# EAGLE design Voyager-expanded_stm_6+ (EAGLE 9.4.2)
Assembly variants: Testing
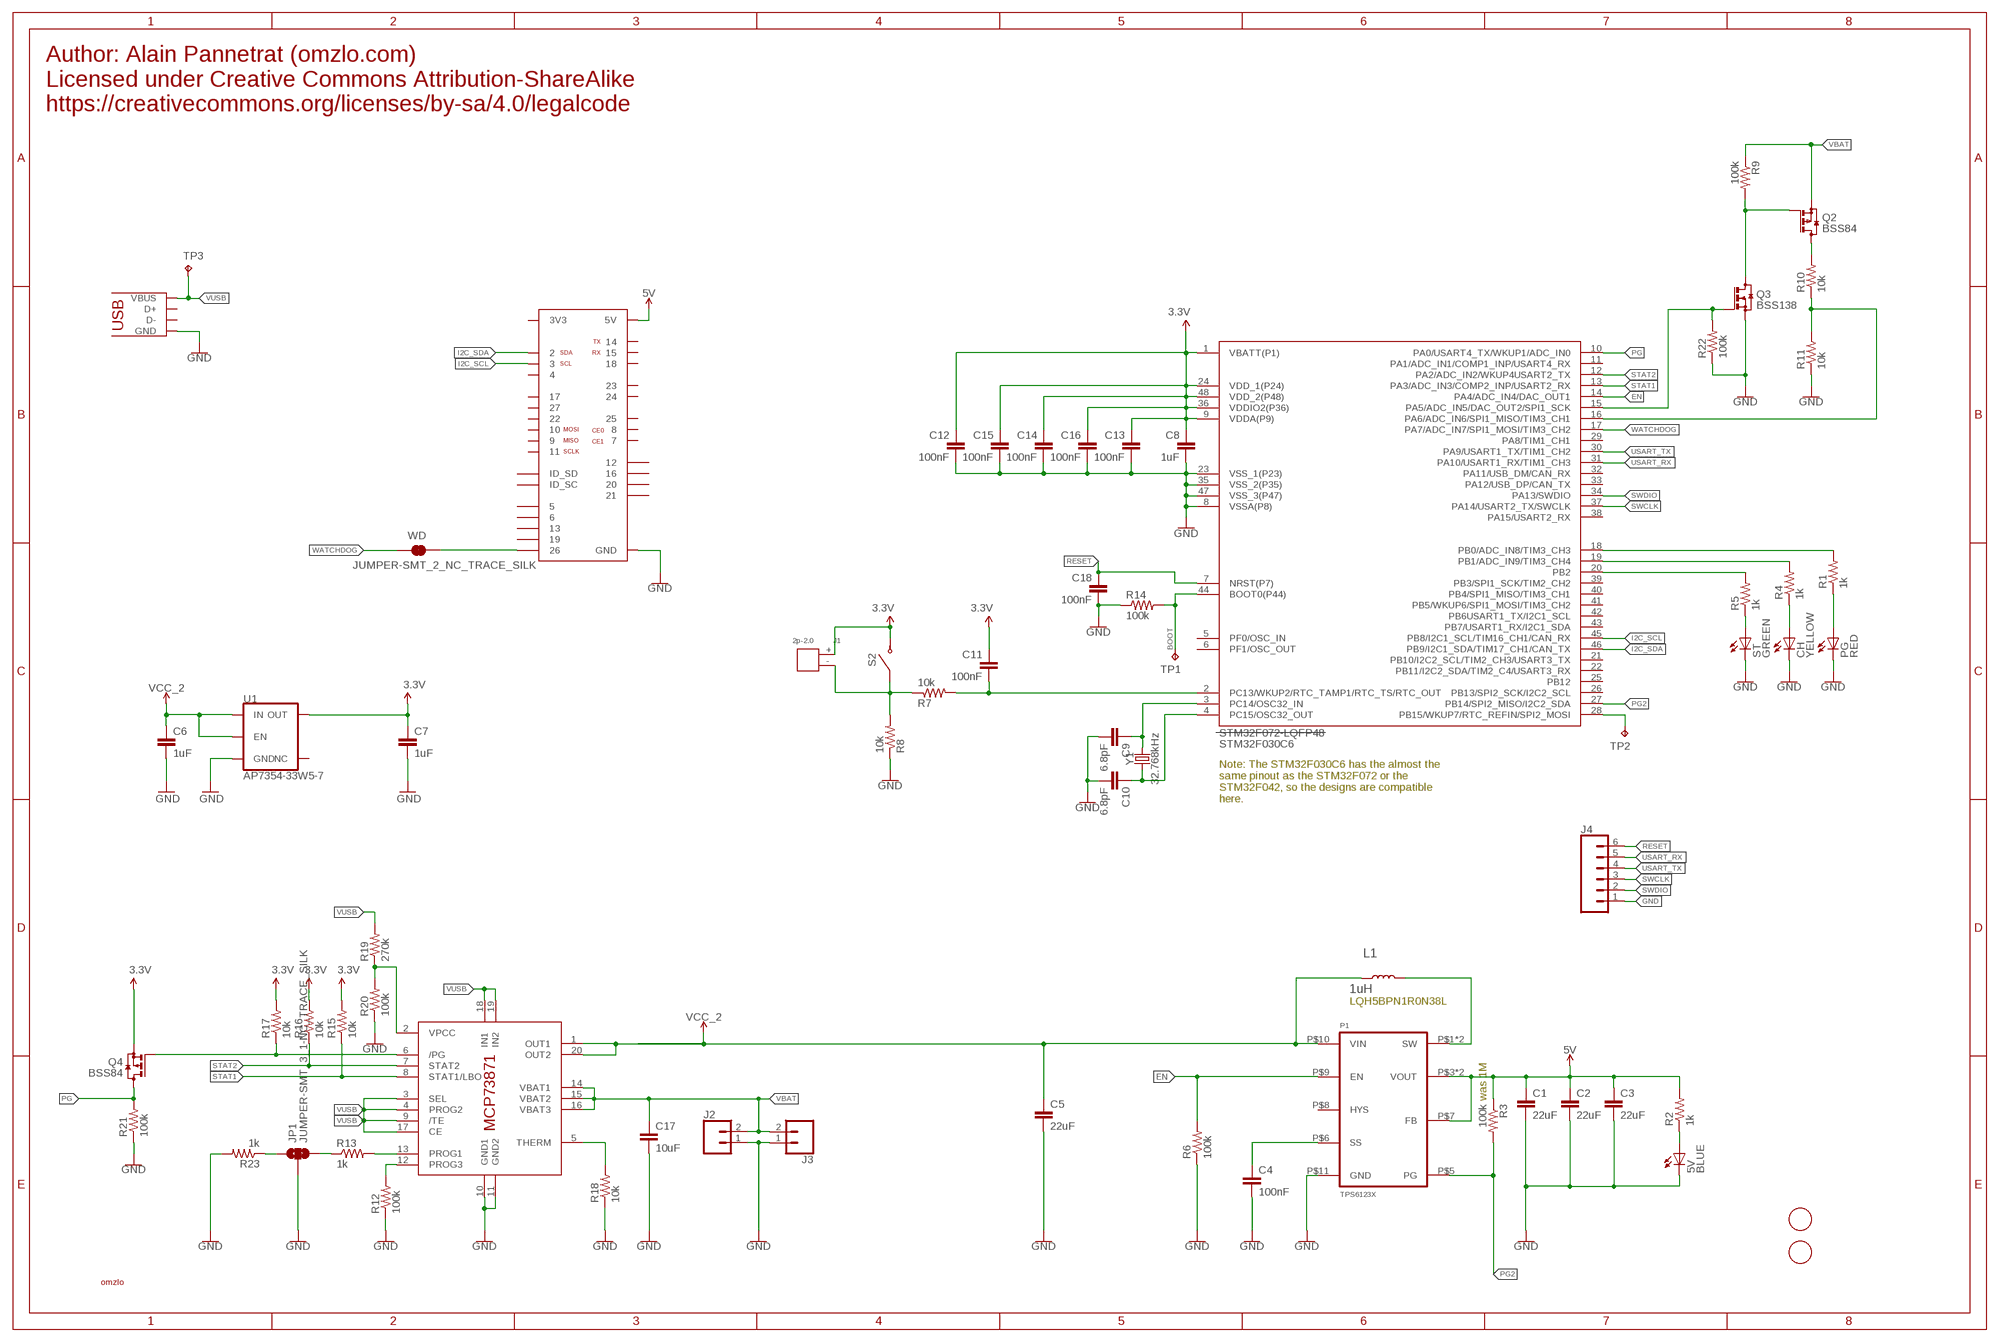
[diagram p0: schematic, sheet 1]

## Parts
5V  BLUE  LEDCHIP-LED0805  [CHIP-LED0805]
C1  22uF  C-EUC1206  [C1206]
C2  22uF  C-EUC1206  [C1206]
C3  22uF  C-EUC1206  [C1206]
C4  100nF  C-EUC0603  [C0603]
C5  22uF  C-EUC1206  [C1206]
C6  1uF  CAP0805  [0805]
C7  1uF  CAP0805  [0805]
C8  1uF  CAP0805  [0805]
C9  6.8pF  C-EUC0603  [C0603]
C10  6.8pF  C-EUC0603  [C0603]
C11  100nF  C-EUC0603  [C0603]
C12  100nF  C-EUC0603  [C0603]
C13  100nF  C-EUC0603  [C0603]
C14  100nF  C-EUC0603  [C0603]
C15  100nF  C-EUC0603  [C0603]
C16  100nF  C-EUC0603  [C0603]
C17  10uF  C-EUC0805  [C0805]
C18  100nF  C-EUC0603  [C0603]
CH  YELLOW  LEDCHIP-LED0805  [CHIP-LED0805]
IC1  MCP73871  [QFN20]
J1  2p-2.0  DIP-JST-2P-2.0  [H2-2.0-6X4.5MM]
J2  CONN_021X02_NO_SILK  [1X02_NO_SILK]
J3  CONN_02-JST-2MM-SMT  [JST-2-SMD]
J4  CONN_06NO_SILK_FEMALE_PTH  [1X06_NO_SILK]
JP1  JUMPER-SMT_3_1-NC_TRACE_SILK  [SMT-JUMPER_3_1-NC_TRACE_SILK]
L1  1uH  SMD-INDUCTOR-10UH-20%-2.35A(2P-5X5X4MM)  [L5040S]
P1  TPS6123X  [PVSON-10]
PG  RED  LEDCHIP-LED0805  [CHIP-LED0805]
Q2  BSS84  [SOT23]
Q3  BSS138  BSS123  [SOT23]
Q4  BSS84  [SOT23]
R1  1k  R-US_R0603  [R0603]
R2  1k  R-US_R0603  [R0603]
R3  100k  R-US_R0603  [R0603]
R4  1k  R-US_R0603  [R0603]
R5  1k  R-US_R0603  [R0603]
R6  100k  R-US_R0603  [R0603]
R7  10k  R-US_R0603  [R0603]
R8  10k  R-US_R0603  [R0603]
R9  100k  R-US_R0603  [R0603]
R10  10k  R-US_R0603  [R0603]
R11  10k  R-US_R0603  [R0603]
R12  100k  R-US_R0603  [R0603]
R13  1k  R-US_R0603  [R0603]
R14  100k  R-US_R0603  [R0603]
R15  10k  R-US_R0603  [R0603]
R16  10k  R-US_R0603  [R0603]
R17  10k  R-US_R0603  [R0603]
R18  10k  R-US_R0603  [R0603]
R19  270k  R-US_R0603  [R0603]
R20  100k  R-US_R0603  [R0603]
R21  100k  R-US_R0603  [R0603]
R22  100k  R-US_R0603  [R0603]
R23  1k  R-US_R0603  [R0603]
S2  TACT-SWITCH  [ALPS-SKSCPDE010]
ST  GREEN  LEDCHIP-LED0805  [CHIP-LED0805]
TP1  TPB1,27  [B1,27]
TP2  TPB1,27  [B1,27]
TP3  TPB1,27  [B1,27]
U1  AP7354-33W5-7  MIC5504-3.33.3V  [SOT23-5]
U$1  RASPBERRY-PI-GPIO  [2X20]
U$2  STM32F072-LQFP48  [LQFP48]
U$3  USB-MICROB  [USB-MICROB]
U$4  FIDUCIAL  [FIDUCIAL_1MM]
U$6  OMZLO  [OMZLO]
U$9  FIDUCIAL  [FIDUCIAL_1MM]
WD  JUMPER-SMT_2_NC_TRACE_SILK  [SMT-JUMPER_2_NC_TRACE_SILK]
Y1  32.768kHz  CRYSTAL-32.768KHZSMD-3.2X1.5  [CRYSTAL-SMD-3.2X1.5MM]

## Nets
3.3V [power]: C7.1 C8.1 C11.1 C12.1 C13.1 C14.1 C15.1 C16.1 J1.+ Q4.2(S) R15.2 R16.2 R17.2 S2.P$3 S2.P$4 U1.5(OUT) U$2.1(VBATT(P1)) U$2.9(VDDA(P9)) U$2.24(VDD_1(P24)) U$2.36(VDDIO2(P36)) U$2.48(VDD_2(P48))
5V: C1.1 C2.1 C3.1 P1.P$3(VOUT) P1.P$4(VOUT) P1.P$7(FB) R2.2 R3.1 U$1.2(5V) U$1.4(5V)
BOOT: R14.2 TP1.TP U$2.44(BOOT0(P44))
EN: P1.P$9(EN) R6.2 U$2.14(PA4/ADC_IN4/DAC_OUT1)
GND: 5V.C C1.2 C2.2 C3.2 C4.2 C5.2 C6.2 C7.2 C8.2 C9.2 C10.2 C12.2 C13.2 C14.2 C15.2 C16.2 C17.2 C18.2 CH.C IC1.10(GND1) IC1.11(GND2) J2.1 J3.1 J4.1 JP1.2 P1.P$11(GND) PG.C Q3.2(S) R6.1 R8.1 R11.1 R12.1 R14.1 R18.1 R20.1 R21.1 R22.1 R23.2 ST.C U1.2(GND) U$1.6(GND) U$1.9(GND) U$1.14(GND) U$1.20(GND) U$1.25(GND) U$1.30(GND) U$1.34(GND) U$1.39(GND) U$2.8(VSSA(P8)) U$2.23(VSS_1(P23)) U$2.35(VSS_2(P35)) U$2.47(VSS_3(P47)) U$3.GND U$3.MT1(GND) U$3.MT2(GND) U$3.P$1(GND) U$3.P$2(GND) U$3.P$3(GND) U$3.P$4(GND)
I2C_SCL: U$1.5 U$2.45(PB8/I2C1_SCL/TIM16_CH1/CAN_RX)
I2C_SDA: U$1.3 U$2.46(PB9/I2C1_SDA/TIM17_CH1/CAN_TX)
N$1: C9.1 U$2.3(PC14/OSC32_IN) Y1.P$2
N$2: C10.1 U$2.4(PC15/OSC32_OUT) Y1.P$1
N$3: IC1.2(VPCC) R19.1 R20.2
N$4: R10.1 R11.2 U$2.16(PA6/ADC_IN6/SPI1_MISO/TIM3_CH1)
N$5: IC1.5(THERM) R18.2
N$6: IC1.12(PROG3) R12.2
N$7: IC1.13(PROG1) R13.2
N$8: R4.2 U$2.19(PB1/ADC_IN9/TIM3_CH4)
N$9: CH.A R4.1
N$10: R5.2 U$2.20(PB2)
N$11: Q2.3(D) R10.2
N$12: C4.1 P1.P$6(SS)
N$13: Q2.1(G) Q3.3(D) R9.2
N$14: L1.2 P1.P$1(SW) P1.P$2(SW)
N$15: R5.1 ST.A
N$16: R1.2 U$2.18(PB0/ADC_IN8/TIM3_CH3)
N$17: 5V.A R2.1
N$18: TP2.TP U$2.28(PB15/WKUP7/RTC_REFIN/SPI2_MOSI)
N$19: J1.- R7.1 R8.2 S2.P$1 S2.P$2
N$20: PG.A R1.1
N$21: U$1.37 WD.2
N$24: JP1.3 R13.1
N$25: JP1.1 R23.1
PG: Q4.3(D) R21.2 U$2.10(PA0/USART4_TX/WKUP1/ADC_IN0)
PG2: P1.P$5(PG) R3.2 U$2.27(PB14/SPI2_MISO/I2C2_SDA)
PG_MCP: IC1.6(/PG) Q4.1(G) R17.1
RESET: C18.1 J4.6 U$2.7(NRST(P7))
STAT1: IC1.8(STAT1/LBO) R15.1 U$2.13(PA3/ADC_IN3/COMP2_INP/USART2_RX)
STAT2: IC1.7(STAT2) R16.1 U$2.12(PA2/ADC_IN2/WKUP4USART2_TX)
SWCLK: J4.3 U$2.37(PA14/USART2_TX/SWCLK)
SWDIO: J4.2 U$2.34(PA13/SWDIO)
SWITCH: C11.2 R7.2 U$2.2(PC13/WKUP2/RTC_TAMP1/RTC_TS/RTC_OUT)
USART_RX: J4.5 U$2.31(PA10/USART1_RX/TIM1_CH3)
USART_TX: J4.4 U$2.30(PA9/USART1_TX/TIM1_CH2)
VBAT: C17.1 IC1.14(VBAT1) IC1.15(VBAT2) IC1.16(VBAT3) J2.2 J3.2 Q2.2(S) R9.1
VBAT_EN: Q3.1(G) R22.2 U$2.15(PA5/ADC_IN5/DAC_OUT2/SPI1_SCK)
VCC_2: C5.1 C6.1 IC1.1(OUT1) IC1.20(OUT2) L1.1 P1.P$10(VIN) U1.1(IN) U1.3(EN)
VUSB: IC1.3(SEL) IC1.4(PROG2) IC1.9(/TE) IC1.17(CE) IC1.18(IN1) IC1.19(IN2) R19.2 TP3.TP U$3.VBUS
WATCHDOG: U$2.17(PA7/ADC_IN7/SPI1_MOSI/TIM3_CH2) WD.1
Unconnected: P1.P$8(HYS) U1.4(NC) U$1.7 U$1.8 U$1.10 U$1.11 U$1.12 U$1.13 U$1.15 U$1.16 U$1.18 U$1.19 U$1.21 U$1.22 U$1.23 U$1.24 U$1.26 U$1.27(ID_SD) U$1.28(ID_SC) U$1.29 U$1.31 U$1.32 U$1.33 U$1.35 U$1.36 U$1.38 U$1.40 U$2.5(PF0/OSC_IN) U$2.6(PF1/OSC_OUT) U$2.11(PA1/ADC_IN1/COMP1_INP/USART4_RX) U$2.21(PB10/I2C2_SCL/TIM2_CH3/USART3_TX) U$2.22(PB11/I2C2_SDA/TIM2_C4/USART3_RX) U$2.25(PB12) U$2.26(PB13/SPI2_SCK/I2C2_SCL) U$2.29(PA8/TIM1_CH1) U$2.32(PA11/USB_DM/CAN_RX) U$2.33(PA12/USB_DP/CAN_TX) U$2.38(PA15/USART2_RX) U$2.39(PB3/SPI1_SCK/TIM2_CH2) U$2.40(PB4/SPI1_MISO/TIM3_CH1) U$2.41(PB5/WKUP6/SPI1_MOSI/TIM3_CH2) U$2.42(PB6USART1_TX/I2C1_SCL) U$2.43(PB7/USART1_RX/I2C1_SDA) U$3.D+ U$3.D-

## Notes on the sheet
- Author: Alain Pannetrat (omzlo.com)
  Licensed under Creative Commons Attribution-ShareAlike
  https://creativecommons.org/licenses/by-sa/4.0/legalcode
- STM32F030C6
- Note: The STM32F030C6 has the almost the
  same pinout as the STM32F072 or the
  STM32F042, so the designs are compatible
  here.
- LQH5BPN1R0N38L
- was 1M

## Power pins joined to a net without a drawn wire
3V3: U$1.1(3V3) U$1.17(3V3)

## Library data of the parts
5V CH PG ST = adafruit:LED: LED OSRAM: - CHIPLED LG R971, LG N971, LY N971, LG Q971, LY Q971, LO R971, LY R971 LH N974, LH R974 LS Q976, LO Q976, LY Q976 LO Q996 - Hyper CHIPLED LW Q18S LB Q993, LB Q99A, LB R99A - SideLED LS A670, LO A670, LY A670, LG A670, LP A670 LB A673, LV A673, LT A673, LW A673 LH A674 LY A675 LS A676, LA A676, LO A676, LY A676, LW A676 LS A679, LY A679, LG A679 - Hyper Micro SIDELED® LS Y876, LA Y876, LO Y876, LY Y876 LT Y87S - SmartLED LW L88C, LW L88S LB L89C, LB L89S, LG L890 LS L89K, LO L89K, LY L89K LS L896, LA L896, LO L896, LY L896 - TOPLED LS T670, LO T670, LY T670, LG T670, LP T670 LSG T670, LSP T670, LSY T670, LOP T670, LYG T670 LG T671, LOG T671, LSG T671 LB T673, LV T673, LT T673, LW T673 LH T674 LS T676, LA T676, LO T676, LY T676, LB T676, LH T676, LSB T676, LW T676 LB T67C, LV T67C, LT T67C, LS T67K, LO T67K, LY T67K, LW E67C LS E67B, LA E67B, LO E67B, LY E67B, LB E67C, LV E67C, LT E67C LW T67C LS T679, LY T679, LG T679 LS T770, LO T770, LY T770, LG T770, LP T770 LB T773, LV T773, LT T773, LW T773 LH T774 LS E675, LA E675, LY E675, LS T675 LS T776, LA T776, LO T776, LY T776, LB T776 LHGB T686 LT T68C, LB T68C - Hyper Mini TOPLED® LB M676 - Mini TOPLED Santana® LG M470 LS M47K, LO M47K, LY M47K Source: http://www.osram.convergy.de/
C1-C5 C11-C18 = resistor:C-EU: CAPACITOR, European symbol
C6-C8 = SparkFun-Capacitors:CAP: Capacitor Standard 0603 ceramic capacitor, and 0.1" leaded capacitor.
C9 C10 = rcl:C-EU: CAPACITOR, European symbol; SPICEPREFIX: C
IC1 = adafruit:MCP73871
J1 = OPL_Connector:DIP-JST-2P-2.0: 320110049
J2 = SparkFun-Connectors:CONN_02: Multi connection point. Often used as Generic Header-pin footprint for 0.1 inch spaced/style header connections On any of the 0.1 inch spaced packages, you can populate with these: Break Away Headers - Straight <https://www.sparkfun.com/products/116> (PRT-00116) Break Away Male Headers - Right Angle <https://www.sparkfun.com/products/553> (PRT-00553) Female Headers <https://www.sparkfun.com/products/115> (PRT-00115) Break Away Headers - Machine Pin <https://www.sparkfun.com/products/117> (PRT-00117) Break Away Female Headers - Swiss Machine Pin <https://www.sparkfun.com/products/743> (PRT-00743) For SCREWTERMINALS and SPRING TERMINALS visit here: Screw Terimnals on SparkFun.com <https://www.sparkfun.com/search/results?term=Screw+Terminals> (5mm/3.5mm/2.54mm spacing) This device is also useful as a general connection point to wire up your design to another part of your project. Our various solder wires solder well into these plated through hole pads. Hook-Up Wire - Assortment (Stranded, 22 AWG) <https://www.sparkfun.com/products/11375> (PRT-11375) Hook-Up Wire - Assortment (Solid Core, 22 AWG) <https://www.sparkfun.com/products/11367> (PRT-11367) View the entire wire category on our website here <https://www.sparkfun.com/categories/141> Special notes: Molex polarized connector foot print use with: PRT-08233 with associated crimp pins and housings. 2.54_SCREWTERM for use with PRT-10571. 3.5mm Screw Terminal footprints for PRT-08084 5mm Screw Terminal footprints for use with PRT-08432
J3 = SparkFun-Connectors:CONN_02: Multi connection point. Often used as Generic Header-pin footprint for 0.1 inch spaced/style header connections On any of the 0.1 inch spaced packages, you can populate with these: Break Away Headers - Straight <https://www.sparkfun.com/products/116> (PRT-00116) Break Away Male Headers - Right Angle <https://www.sparkfun.com/products/553> (PRT-00553) Female Headers <https://www.sparkfun.com/products/115> (PRT-00115) Break Away Headers - Machine Pin <https://www.sparkfun.com/products/117> (PRT-00117) Break Away Female Headers - Swiss Machine Pin <https://www.sparkfun.com/products/743> (PRT-00743) For SCREWTERMINALS and SPRING TERMINALS visit here: Screw Terimnals on SparkFun.com <https://www.sparkfun.com/search/results?term=Screw+Terminals> (5mm/3.5mm/2.54mm spacing) This device is also useful as a general connection point to wire up your design to another part of your project. Our various solder wires solder well into these plated through hole pads. Hook-Up Wire - Assortment (Stranded, 22 AWG) <https://www.sparkfun.com/products/11375> (PRT-11375) Hook-Up Wire - Assortment (Solid Core, 22 AWG) <https://www.sparkfun.com/products/11367> (PRT-11367) View the entire wire category on our website here <https://www.sparkfun.com/categories/141> Special notes: Molex polarized connector foot print use with: PRT-08233 with associated crimp pins and housings. 2.54_SCREWTERM for use with PRT-10571. 3.5mm Screw Terminal footprints for PRT-08084 5mm Screw Terminal footprints for use with PRT-08432; PROD_ID: CONN-11443
J4 = SparkFun-Connectors:CONN_06: Multi connection point. Often used as Generic Header-pin footprint for 0.1 inch spaced/style header connections On any of the 0.1 inch spaced packages, you can populate with these: Break Away Headers - Straight <https://www.sparkfun.com/products/116> (PRT-00116) Break Away Male Headers - Right Angle <https://www.sparkfun.com/products/553> (PRT-00553) Female Headers <https://www.sparkfun.com/products/115> (PRT-00115) Break Away Headers - Machine Pin <https://www.sparkfun.com/products/117> (PRT-00117) Break Away Female Headers - Swiss Machine Pin <https://www.sparkfun.com/products/743> (PRT-00743) Arduino Stackable Header - 6 Pin <https://www.sparkfun.com/products/9280> (PRT-09280) For SCREWTERMINALS and SPRING TERMINALS visit here: Screw Terimnals on SparkFun.com <https://www.sparkfun.com/search/results?term=Screw+Terminals> (5mm/3.5mm/2.54mm spacing) This device is also useful as a general connection point to wire up your design to another part of your project. Our various solder wires solder well into these plated through hole pads. Hook-Up Wire - Assortment (Stranded, 22 AWG) <https://www.sparkfun.com/products/11375> (PRT-11375) Hook-Up Wire - Assortment (Solid Core, 22 AWG) <https://www.sparkfun.com/products/11367> (PRT-11367) View the entire wire category on our website here <https://www.sparkfun.com/categories/141>; PROD_ID: CONN-08437
JP1 = SparkFun-Jumpers:JUMPER-SMT_3_1-NC_TRACE: Normally closed trace jumper (1 of 2 connections) This jumper has a trace between two pads so it's normally closed (NC). The other connection is normally open (NO). Use a razor knife to open the connection. For best results follow the IPC guidelines for cutting traces: Cutout at least 0.063 mm (0.005 in). Remove all loose material to clean up the cut area. Seal the cut with an approved epoxy. Reapply solder to reclose the connection, or to close the NO connection.
L1 = OPL_Inductor:SMD-INDUCTOR-10UH-20%-2.35A(2P-5X5X4MM): 303010147
P1 = AlainElements:TPS6123X: TPS6123x High Efficiency Synchronous Step Up Converters with 5-A Switches http://www.ti.com/lit/ds/symlink/tps61232.pdf
Q2 Q4 = transistor-small-signal:BSS84: P-CHANNEL MOS FET
Q3 = transistor-small-signal:BSS123: N-CHANNEL MOS FET
R1-R23 = resistor:R-US_: RESISTOR, American symbol
S2 = Omzlo-Mechanical:TACT-SWITCH
TP1-TP3 = testpad:TP: Test pad
U1 = Omzlo-PowerIC:MIC5504-3.3: V_REG MIC5504 300ma LDO, stable with 1uF caps; VALUE: MIC5504-3.3V
U$1 = pimoroni-headers:RASPBERRY-PI-GPIO
U$2 = stm32f0:STM32F072
U$3 = pimoroni:USB-MICROB
U$4 U$9 = adafruit:FIDUCIAL: For use by pick and place machines to calibrate the vision/machine, 1mm By microbuilder.eu
U$6 = AlainElements:OMZLO
WD = SparkFun-Jumpers:JUMPER-SMT_2_NC_TRACE: Normally closed trace jumper This jumper has a trace between two pads so it's normally closed (NC). Use a razor knife to open the connection. For best results follow the IPC guidelines for cutting traces: Cutout at least 0.063 mm (0.005 in). Remove all loose material to clean up the cut area. Seal the cut with an approved epoxy. Reapply solder to reclose the connection.
Y1 = SparkFun-Clocks:CRYSTAL-32.768KHZ: 32.768kHz Crystal Frequency: 32.768kHz Frequency Stability: ±20ppm Load Capacitance: 12.5pF (PTH-2X6 & SMD-3.2X1.5), 6pF (SMD-2X6) SparkFun Products: SparkFun BigTime Watch Kit <https://www.sparkfun.com/products/11734> SparkFun nRF52832 Breakout <https://www.sparkfun.com/products/13990> SparkFun Real Time Clock Module <https://www.sparkfun.com/products/12708>; PROD_ID: XTAL-13062

## Net classes
1 power: width 0.305 mm

## Board
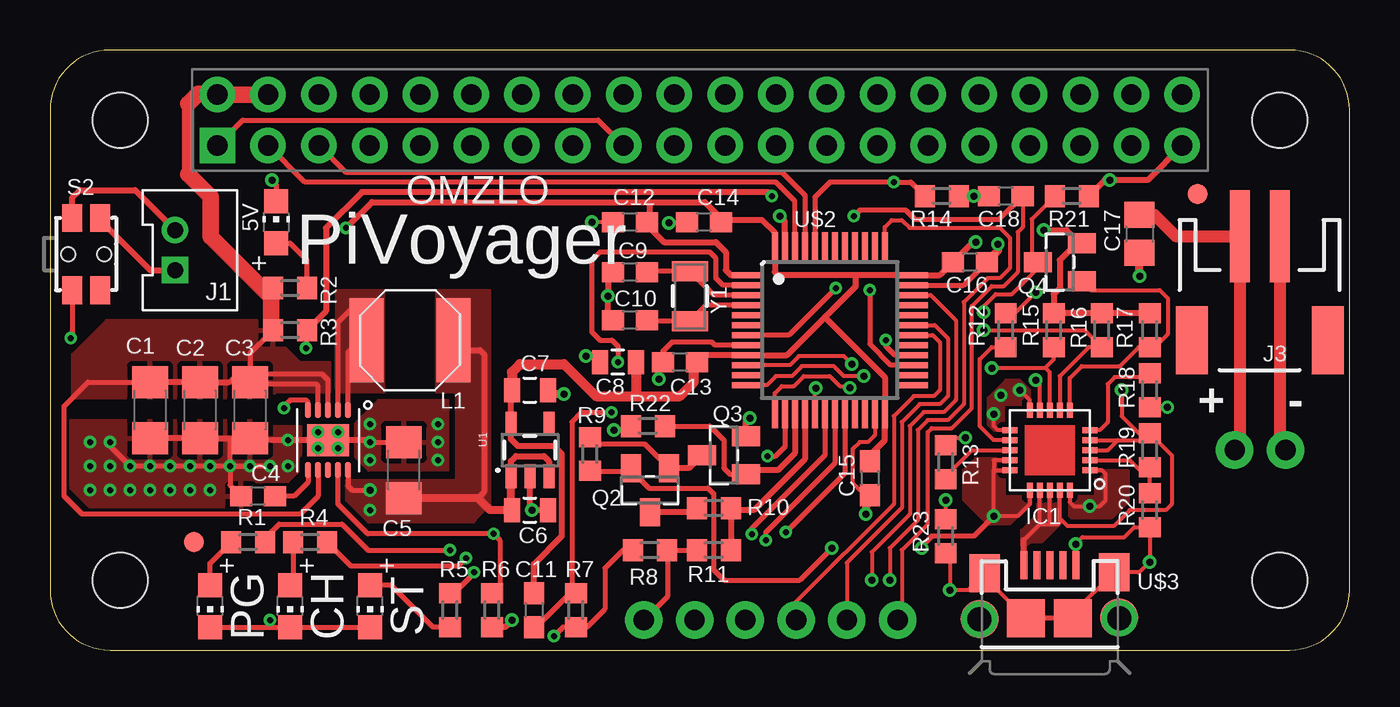
[diagram p1: board, top side]
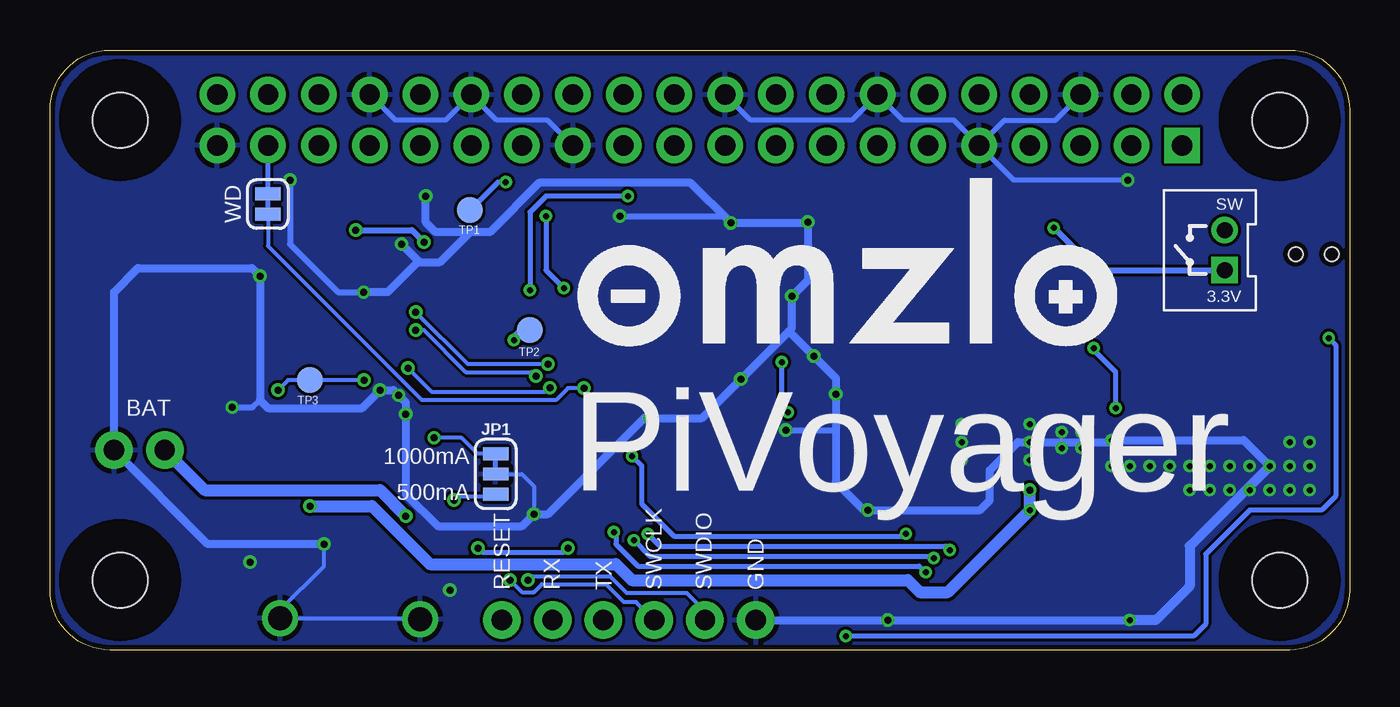
[diagram p2: board, bottom side, seen from below]

Size 65 x 30 mm. Coordinates in mm from the lower left corner, seen from the top.
Outline: 3,0 62,0 arc90 65,3 65,27 arc90 62,30 3,30 arc90 0,27 0,3 arc90 3,0
Copper layers (1*16): Top 0.035mm / dielectric 1.5mm / Bottom 0.035mm
Design rules "SeeedStudio_2layer_DRU_no_angle_20140221 *": minimum track width 6mil, minimum drill 0.3mm, track to track 6mil, track to pad 6mil, pad to pad 6mil, via to via 6mil, smd to smd 0mil, copper to edge 10mil, drill to drill 10mil, minimum pad ring 10mil, minimum via ring 6mil, stop-mask expansion 2mil, vias tented up to drill 100mil, thermal gap 10mil
Holes 2.75 mm at 3.5,3.5 3.5,26.5 61.5,3.5 61.5,26.5
tRestrict: area 0.5,0.5 to 6.5,6.5; area 58.5,0.5 to 64.5,6.5; area 58.5,23.5 to 64.5,29.5; area 0.5,23.5 to 6.5,29.5
bRestrict: area 0.5,23.5 to 6.5,29.5; area 0.5,0.5 to 6.5,6.5; area 58.5,0.5 to 64.5,6.5; area 58.5,23.5 to 64.5,29.5

### Footprints (pad centres in the part's own frame; a part is rotated, then mirrored left to right if it is on the bottom)
CHIP-LED0805 = smd 1.2 x 1.2: A 0,-1.05; C 0,1.05
C1206 = smd 1.6 x 1.8: 1 -1.4,0; 2 1.4,0
C0603 = smd 1.1 x 1: 1 -0.85,0; 2 0.85,0
0805 = smd 0.8 x 1.2: 1 -0.9,0; 2 0.9,0
C0805 = smd 1.3 x 1.5: 1 -0.95,0; 2 0.95,0
QFN20 = smd 0.75 x 0.3: 1 -2,1; 2 -2,0.5; 3 -2,0; 4 -2,-0.5; 5 -2,-1; 11 2,-1; 12 2,-0.5; 13 2,0; 14 2,0.5; 15 2,1 | smd 0.3 x 0.75: 6 -1,-2; 7 -0.5,-2; 8 0,-2; 9 0.5,-2; 10 1,-2; 16 1,2; 17 0.5,2; 18 0,2; 19 -0.5,2; 20 -1,2
H2-2.0-6X4.5MM = drill 0.8 pad 1.3 square: + -1,0.75 | drill 0.8 pad 1.3: - 1,0.75
1X02_NO_SILK = drill 1.016 pad 1.88: 1 0,0; 2 2.54,0
JST-2-SMD = smd 1 x 4.6: 1 -1,-3.7; 2 1,-3.7 | smd 1.6 x 3.4: NC1 -3.4,1.5; NC2 3.4,1.5
1X06_NO_SILK = drill 1.016 pad 1.88: 1 0,0; 2 2.54,0; 3 5.08,0; 4 7.62,0; 5 10.16,0; 6 12.7,0
SMT-JUMPER_3_1-NC_TRACE_SILK = smd 0.635 x 1.27: 1 -1.016,0; 2 0,0; 3 1.016,0
L5040S = smd 4.2 x 1.7: 1 0,2.175; 2 0,-2.175
PVSON-10 = smd 0.28 x 0.825: P$1 -1,-1.5; P$2 -0.5,-1.5; P$3 0,-1.5; P$4 0.5,-1.5; P$5 1,-1.5; P$6 1,1.5; P$7 0.5,1.5; P$8 0,1.5; P$9 -0.5,1.5; P$10 -1,1.5 | smd 2.1 x 1.6: P$11 0,0
SOT23 = smd 1 x 1.4: 1 -0.95,-1.1; 2 0.95,-1.1; 3 0,1.1
R0603 = smd 1 x 1.1: 1 -0.85,0; 2 0.85,0
ALPS-SKSCPDE010 = smd 1.4 x 1: P$1 -1.8,-0.7; P$2 1.8,-0.7; P$3 -1.8,0.7; P$4 1.8,0.7 | hole 0.7: 0,0.9; 0,-0.9
B1,27 = smd 1.27 x 1.27: TP 0,0
SOT23-5 = smd 1.2 x 0.55: 1 -1.3,0.95; 2 -1.3,0; 3 -1.3,-0.95; 4 1.3,-0.95; 5 1.3,0.95
2X20 = drill 1.016 pad 1.778 square: 1 -24.13,-1.27 | drill 1.016 pad 1.778: 2 -24.13,1.27; 3 -21.59,-1.27; 4 -21.59,1.27; 5 -19.05,-1.27; 6 -19.05,1.27; 7 -16.51,-1.27; 8 -16.51,1.27; 9 -13.97,-1.27; 10 -13.97,1.27; 11 -11.43,-1.27; 12 -11.43,1.27; 13 -8.89,-1.27; 14 -8.89,1.27; 15 -6.35,-1.27; 16 -6.35,1.27; 17 -3.81,-1.27; 18 -3.81,1.27; 19 -1.27,-1.27; 20 -1.27,1.27; 21 1.27,-1.27; 22 1.27,1.27; 23 3.81,-1.27; 24 3.81,1.27; 25 6.35,-1.27; 26 6.35,1.27; 27 8.89,-1.27; 28 8.89,1.27; 29 11.43,-1.27; 30 11.43,1.27; 31 13.97,-1.27; 32 13.97,1.27; 33 16.51,-1.27; 34 16.51,1.27; 35 19.05,-1.27; 36 19.05,1.27; 37 21.59,-1.27; 38 21.59,1.27; 39 24.13,-1.27; 40 24.13,1.27
LQFP48 = smd 1.5 x 0.3: 1 -4.15,2.75; 2 -4.15,2.25; 3 -4.15,1.75; 4 -4.15,1.25; 5 -4.15,0.75; 6 -4.15,0.25; 7 -4.15,-0.25; 8 -4.15,-0.75; 9 -4.15,-1.25; 10 -4.15,-1.75; 11 -4.15,-2.25; 12 -4.15,-2.75; 25 4.15,-2.75; 26 4.15,-2.25; 27 4.15,-1.75; 28 4.15,-1.25; 29 4.15,-0.75; 30 4.15,-0.25; 31 4.15,0.25; 32 4.15,0.75; 33 4.15,1.25; 34 4.15,1.75; 35 4.15,2.25; 36 4.15,2.75 | smd 0.3 x 1.5: 13 -2.75,-4.15; 14 -2.25,-4.15; 15 -1.75,-4.15; 16 -1.25,-4.15; 17 -0.75,-4.15; 18 -0.25,-4.15; 19 0.25,-4.15; 20 0.75,-4.15; 21 1.25,-4.15; 22 1.75,-4.15; 23 2.25,-4.15; 24 2.75,-4.15; 37 2.75,4.15; 38 2.25,4.15; 39 1.75,4.15; 40 1.25,4.15; 41 0.75,4.15; 42 0.25,4.15; 43 -0.25,4.15; 44 -0.75,4.15; 45 -1.25,4.15; 46 -1.75,4.15; 47 -2.25,4.15; 48 -2.75,4.15
USB-MICROB = smd 0.35 x 1.4: D+ 0,2.65; D- -0.65,2.65; GND 1.3,2.65; ID 0.65,2.65; VBUS -1.3,2.65 | smd 1.546 x 1.9: MT1 -3.251,2.235; MT2 3.226,2.286 | smd 1.9 x 1.9: P$1 -1.194,0; P$2 1.168,0; P$5 -3.505,-0.051; P$6 3.48,0.025 | drill 1.2 pad 1.6: P$3 -3.505,-0.051; P$4 3.48,0
FIDUCIAL_1MM = smd 1 x 1: 1 0,0
SMT-JUMPER_2_NC_TRACE_SILK = smd 0.635 x 1.27: 1 -0.508,0; 2 0.508,0
CRYSTAL-SMD-3.2X1.5MM = smd 1 x 1.8: P$1 -1.25,0; P$2 1.25,0

### Placement (x,y rotation side)
5V  11.3,21.39 0 top
C1  5,12 270 top
C2  7.5,12 270 top
C3  10,12 270 top
C4  10.4,7.7 180 top
C5  17.7,9 90 top
C6  24,7 0 top
C7  24,13 0 top
C8  28.4,14.4 180 top
C9  29,18.9 180 top
C10  29,16.5 180 top
C11  24.2,2 270 top
C12  29,21.4 180 top
C13  31.5,14.4 180 top
C14  32.7,21.4 180 top
C15  41,8.6 270 top
C16  46,19.4 0 top
C17  54.49,20.81 270 top
C18  47.8,22.7 180 top
CH  12,2.2 180 top
IC1  50,10 180 top
J1  7,20 90 top
J2  61.8,10 180 top
J3  60.5,17 180 top
J4  29.7,1.5 0 top
JP1  42.7,8.8 90 bottom
L1  18,15.5 270 top
P1  13.9,10.5 180 top
PG  8,2.2 180 top
Q2  30,8 180 top
Q3  33.7,9.75 90 top
Q4  50.5,19.4 90 top
R1  9.9,5.4 0 top
R2  12,18.1 180 top
R3  12,16 0 top
R4  13,5.4 0 top
R5  20,2 90 top
R6  22.1,2 90 top
R7  26.3,2 90 top
R8  30,5 180 top
R9  27,9.8 90 top
R10  33.2,7.1 180 top
R11  33.2,5 0 top
R12  47.8,16 270 top
R13  44.8,9.4 270 top
R14  44.6,22.7 180 top
R15  50.2,16 90 top
R16  52.6,16 90 top
R17  55,16 90 top
R18  55,13 90 top
R19  55,10 90 top
R20  55,7 90 top
R21  51.1,22.7 180 top
R22  29.9,11.2 0 top
R23  44.8,5.7 270 top
S2  1.8,19.8 270 top
ST  16,2.2 180 top
TP1  44,22 0 bottom
TP2  41,16 0 bottom
TP3  52,13.5 0 bottom
U1  24,10 90 top
U$1  32.5,26.5 0 top
U$2  39,16 0 top
U$3  50,1.6 0 top
U$4  57.4,22.8 0 top
U$6  38.6,15.2 0 bottom
U$9  7.2,5.4 0 top
WD  54.1,22.3 90 bottom
Y1  32,17.7 90 top

### Tracks (layer width: path | path; a pad name or v marks a point on that pad's centre or on a via)
3.3V  (via drill 0.3, 0.35)
  Top 0.305: 32.1,14.65 32.2,14.75 U$2.9 36.85,14.75 38.75,16.65 | 38.75,16.65 41.75,13.65 U$2.24 41.75,10.5 41,9.75 C15.1 | 40.3,18.7 40.25,18.75 36.4,18.75 36.25,18.9 U$2.48 36.25,20.85 35.6,21.5 33.65,21.5 | 40.3,18.7 40.35,18.75 U$2.36 44.5,18.75 C16.1 46.15,20.4 v46.3,20.4 | C14.1 33.65,21.5 | 38.75,16.65 40.3,18.2 40.3,18.7 | S2.P$3 2.5,21.5 5,19 J1.+ | v14.8,21.1 16.1,22.4 30,22.4 | C11.1 24.2,4.3 25.61,5.71 25.61,9.79 25.2,10.2 23.4,10.2 23.05,10.55 U1.5 23.05,12.95 | R17.2 R16.2 R15.2 50.2,17.8 50.5,18.1 50.5,19.5 51.05,20.05 51.3,20.05 Q4.2 51.5,20.35 50.85,21 v49.7,21 | U$2.1 34.05,18.75 33.8,19 33.8,19.9 33.3,20.4 30.7,20.4 29.85,21.25 C12.1 30,21.55 30,22.4 | 33.65,21.5 32.75,22.4 30,22.4
  Top 0.508: 32.1,14.65 32.2,14.55 | 32.2,14.55 C13.1 | 29.3,12.7 31.5,12.7 32.2,13.4 32.2,14.55 | C8.1 29.3,12.7 | 29.3,12.7 27.3,12.7 25.7,14.3 23.5,14.3 23.1,13.9 C7.1 23.05,12.95
  Bottom 0.305: v14.8,21.1 12.7,19 J1.+ | v49.7,21 46.9,21 v46.3,20.4
3V3
  Top 0.254: U$1.1 9.64,26.5 27.42,26.5 U$1.17
5V
  Top 0.203: 10.1,13.3 C3.1 8.93,13.4 | 7.53,13.37 C2.1 | 9.33,13.8 8.93,13.4 | 8.93,13.4 8.9,13.37
  Top 0.254: P1.P$4 13.4,13.2 13.3,13.3 10.1,13.3 | P1.P$3 13.9,13.5 13.6,13.8 9.33,13.8 | 8.34,27.8 U$1.2 | P1.P$7 13.4,7.7 12.5,6.8 1.6,6.8 0.7,7.7 0.7,12.2 1.9,13.4 C1.1 | R3.1 10,14.85 C3.1 | R2.2 11.05,18 11.05,17.65
  Top 0.305: 8.9,13.37 7.53,13.37 | C2.1 C1.1
  Top 0.61: C1.1 5,13.7 | 6.9,23.8 6.9,27.3
  Top 0.813: 6.9,27.3 7.4,27.8 8.34,27.8 | U$1.2 U$1.4 | 6.9,23.8 8.03,22.68 8.03,20.68 11.05,17.65 11.05,16.1 R3.1
  pour Top: 11.3,12.9 14,12.9 14,14.4 12.5,14.4 11.6,15.3 11.6,16.5 2.8,16.5 1.1,14.8 1.1,12.6 11,12.6
BOOT  (via drill 0.3)
  Top 0.254: U$2.44 38.25,22.64 39.01,23.4 v42.2,23.4 43.05,23.4 R14.2
  Bottom 0.254: TP1.TP 42.6,23.4 v42.2,23.4
EN  (via drill 0.3)
  Top 0.254: U$2.14 36.75,10.16 36.29,9.7 v35.88,9.7 | P1.P$9 14.4,7.3 15.89,5.81 v22.18,5.81 22.5,5.49 22.5,3.25 R6.2
  Bottom 0.254: v35.88,9.7 35.4,9.22 35.4,7.3 33.8,5.7 22.18,5.7 v22.18,5.81
GND  (via drill 0.3, 0.35)
  Top 0.2: U$2.23 41.25,10.75 40.9,10.4 40.5,10.4 40.15,10.05 40.15,8.35 40.5,8 40.75,8 C15.2 | IC1.10 49,12.5 v48.5,13 | IC1.11 47.4,11 47.2,11.2 v47.2,11.8 | U$3.P$2 51.17,1.83 U$3.MT2 54.49,3.89 v55,4.4 R20.1 54.25,6.15 53.75,5.65 51.65,5.65 v51.3,5.3 | U$3.P$1 46.75,3.66 U$3.MT1 45.91,3 v45,3 45,4.65 R23.2
  Top 0.203: R12.1 48.27,16.85 v49.31,17.89 | C14.2 31.8,21.35 v30.95,21.35 | C12.2 v27.1,21.4
  Top 0.254: 11.1,10.5 10.1,10.5 C3.2 8.97,10.6 9,10.57 v9,9.2 | 7.53,10.57 C2.2 | 15.9,10.5 v16,10.4 C5.2 | U$3.P$2 U$3.P$1 | U$2.8 33.25,15.25 33.1,15.4 31.1,15.4 30.65,14.95 C13.2 30.45,14.2 v30.45,13.55 | v9,9.2 9,8.25 C4.2 | v10,9.2 v8,9.2 v7,9.2 v6,9.2 v5,9.2 v4,9.2 3,10.2 v3,10.4 | v11,9.2 v10,9.2 | v9,9.2 v10,9.2 | PG.C 11,1.15 | 11,1.15 CH.C ST.C | C18.2 v46.2,22.7 R14.1 | U$2.35 45.7,18.25 C16.2 | 11,1.15 v11,1.5 | R8.1 30.9,5 | 30.9,5 R11.1 | J4.1 30.9,2.7 30.9,5 | 5V.C 11.3,23.3 v11.1,23.5
  Top 0.305: 11.1,10.5 P1.P$11 15.9,10.5 | 9,10.57 7.53,10.57 | C2.2 C1.2 | U$3.GND v51.3,5.3 | U1.2 24,7.1 v24.1,7 C6.2 | C10.2 27.9,16.75 v27.9,17.7 27.9,18.65 C9.2 | v55.88,12.14 v55.87,12.15 R18.1 | R22.1 28.85,11 v28.2,11 | U$2.47 36.75,21.45 v36.5,21.7 | U$1.39 54.9,23.5 v53,23.5 52.75,23.5 R21.1 | Q3.2 34.8,11.4 v35,11.6 | v23.1,1.5 22.75,1.15 R6.1
  Top 0.406: v54.5,18.7 v54.49,18.71 C17.2 | C16.2 47.42,19.97 v47.42,20.3 | v25.7,12.8 25.1,12.8 C7.2 | C8.2 27.2,14.7 v26.8,14.7 | C15.2 40.8,7.55 v40.8,6.8
  Top 0.61: J3.1 61.5,10.3 J2.1
  Bottom 0.2: U$3.P$3 46.55,1.6 U$3.P$4 53.48,2.02 51.3,4.2 v51.3,5.3 | JP1.2 41.4,8.8 40.8,8.2 v40.8,6.8
  Bottom 0.254: U$1.9 19.8,26.5 22.34,26.5 U$1.14 24.88,26.5 29.96,26.5 U$1.20 | U$1.9 17.26,26.5 14.72,26.5 U$1.6 | U$1.25 40.12,26.5 42.66,26.5 U$1.30 45.2,26.5 47.7,26.5 48.97,27.77 U$1.34 | v11.1,23.5 16.8,23.5 U$1.9
  Bottom 0.305: v55.88,12.14 54.86,12.14 54.5,12.5 | v28.2,11 25.7,11 | v36.5,21.7 31.3,21.7 v30.95,21.35 | v53,23.5 53,20.3 50.59,17.89 v49.31,17.89
  Bottom 0.406: v51.3,5.3 57.1,5.3 J2.1 61.8,17.9 60.6,19.1 54.9,19.1 v54.5,18.7 54.5,12.5 54.1,12.1 49.4,12.1 v48.5,13 47.82,13 v47.56,12.74 47.2,12.38 v47.2,11.8 47.2,7.8 45.6,6.2 41.4,6.2 v40.8,6.8 40.1,6.8 35.3,11.6 v35,11.6 32.4,11.6 v30.45,13.55 28.05,15.95 | 28.05,15.95 27.9,16.1 v27.9,17.7 27.1,18.5 v27.1,21.4 27.15,21.35 v30.95,21.35 32.96,23.36 40.54,23.36 43,20.9 44,20.9 | 44,20.9 45.7,20.9 46.2,21.4 v46.2,22.7 | v47.42,20.3 46.56,19.44 | 46.56,19.44 46.52,19.4 45.5,19.4 44,20.9 | 46.56,19.44 48.11,17.89 v49.31,17.89 | 28.05,15.95 v26.8,14.7 25.7,13.6 v25.7,12.8 25.7,11 25.7,8.4 24.3,7 v24.1,7 18.5,7 18,7.5 18,9 16.6,10.4 v16,10.4 12,10.4 v11.9,10.5 5.3,10.5 v4,9.2 | v11,1.5 v23.1,1.5 J4.1
  Bottom 0.508: v11,1.5 9.7,1.5 8,3.2 8,5.2 v4,9.2
  other vias: 2,8 3,8 4,8 5,8 6,8 7,8 8,8 16,11.3 16,9.5 11.9,9.2 13.4,10.1 14.4,10.9 13.4,10.9 14.4,10.1 19.4,11.3 19.4,10.4 19.4,9.5 3,9.2 2,9.2 2,10.4
  pour Top: 11.1,11.2 15.1,11.2 16.4,12.5 19.9,12.5 19.9,9 15.9,9 15.1,9.8 12.6,9.8 12.4,9.6 12.4,8.9 11.9,8.4 10.2,8.4 9.7,7.9 9.7,7.1 2,7.1 1,8.1 1,11.5 10.8,11.5
  pour Bottom: 0,0 65,0 65,30 0,30
  pour Top: 47.7,11 47.7,12.3 49,12.3 49,13 48.5,13.5 47.8,13.5 46.9,12.6 46.9,11.3 47.2,11
I2C_SCL
  Top 0.254: U$1.5 14.78,23.9 36.6,23.9 37.75,22.75 U$2.45
I2C_SDA
  Top 0.254: U$1.3 12.74,23.4 36.3,23.4 37.25,22.45 U$2.46
N$1
  Top 0.254: U$2.3 33.2,17.75 Y1.P$2 30,18.95 C9.1
N$2
  Top 0.254: U$2.4 32.8,17.25 Y1.P$1 29.91,16.45 C10.1
N$3
  Top 0.2: IC1.2 54,9.5 54.5,9 54.85,9 R19.1 R20.2
N$4
  Top 0.305: R10.1 34.05,7 | 34.05,7 R11.2 | U$2.16 37.75,9.55 35.2,7 34.05,7
N$5
  Top 0.2: R18.2 54.8,13.65 53.25,13.65 52.9,13.3 52.9,11.4 52.5,11 IC1.5
N$6
  Top 0.2: IC1.12 47.2,10.5 46.5,11.2 46.5,14.55 47.1,15.15 R12.2
N$7
  Top 0.2: R13.2 44.8,8.7 46.1,10 IC1.13
N$8  (via drill 0.3)
  Top 0.254: U$2.19 39.25,9.35 35.8,5.9 v35.8,5.49 | v20.8,4.6 20.4,4.2 15.05,4.2 R4.2
  Bottom 0.254: v35.8,5.49 35.01,4.7 20.8,4.7 v20.8,4.6
N$9
  Top 0.254: R4.1 12.15,3.4 CH.A
N$10  (via drill 0.3)
  Top 0.254: U$2.20 39.75,8.85 v36.8,5.9 | R5.2 20.2,2.85 21.2,3.85 v21.2,3.89
  Bottom 0.254: v36.8,5.9 36.7,5.8 36.7,5.3 35.6,4.2 21.51,4.2 v21.2,3.89
N$11
  Top 0.305: R10.2 32.15,6.9 Q2.3
N$12
  Top 0.254: P1.P$6 12.9,8.4 12.2,7.7 C4.1
N$13
  Top 0.254: Q2.1 29.75,10.3 27.35,10.3 R9.2
  Top 0.305: Q3.3 31.95,9.1 Q2.1
N$14
  Top 0.254: P1.P$2 14.4,15 14.4,15.34 14.4,16.4 15,17 16,17 16,16 | P1.P$1 14.9,14.9 16,16 | 16,16 16.03,16.03
  pour Top (no thermals): 14.5,12.9 16.7,12.9 16.7,18 14.3,18 14.3,13.1
N$15
  Top 0.254: R5.1 19.15,1.15 17.05,3.25 ST.A
N$16  (via drill 0.3)
  Top 0.254: U$2.18 38.75,9.75 35.1,6.1 v35.1,5.8 | R1.2 10.75,5.6 11.45,6.3 14.6,6.3 15.9,5 v20,5
  Bottom 0.254: v35.1,5.8 34.5,5.2 20.2,5.2 v20,5
N$17
  Top 0.254: R2.1 12.85,19.49 12,20.34 5V.A
N$18  (via drill 0.3)
  Top 0.254: U$2.28 42.25,14.75 41.8,15.2 v41.8,15.5
  Bottom 0.254: v41.8,15.5 41.8,15.7 41.5,16 TP2.TP
N$19  (via drill 0.3)
  Top 0.254: S2.P$2 1.1,15.66 v1.03,15.6 | v25.2,0.7 25.65,1.15 R7.1 26.85,1.15 27.75,2.05 27.75,4.1 28.65,5 R8.2
  Top 0.305: S2.P$1 1.1,22.6 1.5,23 4.25,23 J1.-
  Bottom 0.254: v1.03,15.6 0.7,15.27 0.7,7.7 1.4,7 5,7 7.2,4.8 7.2,1.3 7.8,0.7 v25.2,0.7
N$20
  Top 0.254: R1.1 8,4.35 PG.A
N$21
  Bottom 0.254: WD.2 U$1.37
N$24  (via drill 0.35)
  Top 0.2: R13.1 45.16,10.61 v45.79,10.61
  Bottom 0.2: JP1.3 43.62,9.82 44.41,10.61 v45.79,10.61
N$25  (via drill 0.35)
  Top 0.2: R23.1 v44.8,7.5
  Bottom 0.2: v44.8,7.5 44.6,7.7 42.78,7.7 JP1.1
PG  (via drill 0.35)
  Top 0.2: U$2.10 37,14.25 37.45,14.7 39.7,14.7 v40.1,14.3 | v46.7,16.9 46.7,17.2 47.3,17.8 48.1,17.8 49.4,19.1 Q4.3 49.1,19.7 49.1,21.55 R21.2
  Bottom 0.2: v40.1,14.3 44.1,14.3 v46.7,16.9
PG2  (via drill 0.3)
  Top 0.254: P1.P$5 12.9,12.4 12.8,12.5 12,12.5 11.7,12.2 v11.7,12.1 | v12.8,15.1 12.85,15.15 R3.2 | v36.1,22.7 35.9,22.9 | v41,18 41,15.3 42.05,14.25 U$2.27
  Top 0.305: 35.9,22.9 15.6,22.9 13.8,21.1 13.8,16.95 R3.2
  Bottom 0.254: v11.7,12.1 11.7,13.9 12.8,15 v12.8,15.1 | v41,18 41,21.9 40.2,22.7 v36.1,22.7
PG_MCP
  Top 0.2: IC1.6 51,13.6 51.6,14.2 53.5,14.2 54.45,15.15 R17.1 55.25,15.15 55.9,15.8 55.9,17.6 55.5,18 52.05,18 Q4.1
RESET  (via drill 0.3)
  Top 0.203: J4.6 42.6,1.7 42.6,5 43.9,6.3 43.9,10.9 44.1,11.1 45.1,11.1 46.1,12.1 46.1,17.2 47.1,18.2 47.7,18.2 48.4,18.9 48.4,20.9 48.65,21.15 C18.1
  Top 0.254: C18.1 47.46,21.51 43.29,21.51 42.8,22 40.5,22 v40.2,21.7 | v39.3,18.1 36.95,15.75 U$2.7
  Bottom 0.254: v40.2,21.7 40.2,19 v39.3,18.1
STAT1  (via drill 0.35)
  Top 0.2: IC1.8 50,13.9 49.8,14.1 v47.1,14.1 49.75,14.1 50.2,14.55 R15.1 | U$2.13 36.25,12.85 36.6,13.2 37.2,13.2 37.7,13.7 39,13.7 39.5,13.2 39.92,13.2 v40,13.12
  Bottom 0.2: v47.1,14.1 45.92,12.92 40.2,12.92 v40,13.12
STAT2  (via drill 0.35)
  Top 0.2: IC1.7 50.5,13.7 51.95,15.15 R16.1 51.75,16 v46.7,16 | U$2.12 35.85,13.25 36.3,13.7 37.1,13.7 37.6,14.2 39.2,14.2 39.7,13.7 v40.7,13.7
  Bottom 0.2: v46.7,16 46.3,16 44.2,13.9 40.9,13.9 v40.7,13.7
SWCLK  (via drill 0.35)
  Top 0.2: U$2.37 41.75,21.15 42.1,21.5 42.6,21.5 43,21.1 47.5,21.1 48,20.6 48,19.1 | 45.7,12.3 44.9,11.5 43.9,11.5 43.4,11
  Top 0.203: 48,19.1 47.5,18.6 46.9,18.6 45.7,17.4 45.7,12.3 | 43.4,11 43.4,6.5 42,5.1 v42,3.5
  Bottom 0.203: J4.3 35.68,2.4 36.3,2.4 37.2,3.3 40.4,3.3 40.8,2.9 41.4,2.9 v42,3.5
SWDIO  (via drill 0.35)
  Top 0.2: 45.3,12.5 44.7,11.9 43.7,11.9 43,11.2
  Top 0.203: U$2.34 44.05,17.75 45.3,16.5 45.3,12.5 | 43,11.2 43,6.8 41.1,4.9 v41.1,3.5
  Bottom 0.203: J4.2 32.24,1.94 33.15,2.85 36.15,2.85 37,3.7 40.9,3.7 v41.1,3.5
SWITCH  (via drill 0.3)
  Top 0.254: C11.2 24.3,1.15 26,2.85 R7.2 26.1,3.05 26.1,11.4 26.59,11.89 v28.09,11.89 | U$2.2 33.65,18.25 33.3,18.6 33.3,19.6 33,19.9 27.5,19.9 27.09,19.5 27.09,15.9 27.5,15.5 28.1,15.5 28.4,15.2 v28.4,14.4
  Bottom 0.254: v28.09,11.89 28.4,12.2 v28.4,14.4
USART_RX
  Top 0.203: U$2.31 44.25,16.25 44.9,15.6 44.9,12.7 44.5,12.3 43.5,12.3 42.6,11.4 42.6,7.1 39.86,4.36 J4.5
USART_TX
  Top 0.2: 37.32,2.42 J4.4
  Top 0.203: U$2.30 44.15,15.75 44.5,15.4 44.5,13 44.2,12.7 43.2,12.7 42.2,11.7 42.2,7.3 37.32,2.42
VBAT  (via drill 0.35)
  Top 0.2: IC1.14 47.2,9.5 47.2,9 | 47.2,9 IC1.15 | 47.2,9 v47.2,6.7 48.4,6.7 49,7.3 IC1.16
  Top 0.254: R9.1 28.9,8.95 Q2.2 29.05,9 29.95,8.1 32.9,8.1 33.2,7.8 33.2,4 33.7,3.5 37.5,3.5 v39.1,5.1 | v43.6,5.1 43.6,5.2 44.1,5.7 46.2,5.7 v47.2,6.7
  Top 0.61: J2.2 59.5,10.24 J3.2 56.3,20.7 55.24,21.76 C17.1
  Bottom 0.254: v43.6,5.1 43.4,4.9 39.3,4.9 v39.1,5.1
  Bottom 0.61: J2.2 57.26,8 48.5,8 v47.2,6.7
  pour Top: 47.7,9.6 47.7,7.7 49,7.7 49,7.3 48,6.3 46.9,6.3 45.7,7.5 45.7,9 46.3,9.6
VBAT_EN
  Top 0.254: R22.2 33,11.2 33.7,10.5 33.7,9.1 34,8.8 Q3.1
  Top 0.305: U$2.15 37.25,9.85 36.4,9 35.4,9 35.2,8.8 Q3.1
VCC_2  (via drill 0.3, 0.35)
  Top 0.2: IC1.20 51,7.4 51.2,7.2 v52,7.2 52.5,7.2 52.8,7.5 52.8,8.8 52.6,9 IC1.1
  Top 0.254: P1.P$10 14.9,8.2 15.1,8 v16,8
  Top 0.305: L1.1 20.68,15 21.5,15 21.7,14.8 21.7,7.9 21.4,7.6 | U1.1 23.05,9.45 23.3,9.7 24.7,9.7 24.95,9.45 U1.3
  Top 0.406: C5.1 21.4,7.6 22,7 C6.1 23.05,7.05 U1.1
  Bottom 0.61: v52,7.2 48.9,7.2 46,4.3 36.7,4.3 35.9,3.5 22.1,3.5 21.5,2.9 20.1,2.9 v16,7 v16,8
  pour Top (no thermals): 14.8,8.5 14.8,7.5 15.9,6.4 21.18,6.4 21.74,7 22,7 22,18 19.3,18 19.3,12.9 20.3,12.9 20.3,8.5
  pour Top: 51,7.7 52.3,7.7 52.3,9 53.9,9 53.9,7.4 53.1,6.6 51.1,6.6 51,6.7
VUSB  (via drill 0.35)
  Top 0.2: 48.7,5.5 49.5,6.3 | 49.5,6.3 IC1.17 | 49.5,6.3 50,6.3 | 50,6.3 50.4,6.3 50.5,6.4 50.5,6.6 | 50.5,6.6 IC1.19 | 50,6.3 IC1.18 | IC1.4 53.4,10.5 | 53.4,10.5 54.65,10.5 54.73,10.57 | 54.73,10.57 R19.2 56.1,9.75 56.1,7.3 55.8,7 54,7 53.2,6.2 50.9,6.2 50.5,6.6 | IC1.3 52.9,10 53.4,10.5 | IC1.9 49.5,13.3 v49.3,13.5 | 54.73,10.57 53.6,11.7 v53.6,13
  Top 0.305: U$3.VBUS 48.7,5.5
  Bottom 0.152: TP3.TP 51,13.5
  Bottom 0.2: v49.3,13.5 51,13.5 53.1,13.5 v53.6,13
  pour Top: 49.4,7.7 50.5,7.7 50.5,6.3 49.6,5.4 49,5.4 48.8,5.2 48.8,5 48.6,5 48.6,6 49.4,6.8
WATCHDOG  (via drill 0.35)
  Top 0.2: U$2.17 38.25,13.05 v38.3,13.1
  Bottom 0.2: WD.1 54.1,20.2 46.4,12.5 39.7,12.5 39.1,13.1 v38.3,13.1

### Text on the board
tPlace: OMZLO | PiVoyager | + | -
bPlace: SW | 3.3V | BAT | PiVoyager | GND | SWDIO | SWCLK | TX | RX | RESET
bNames: 1000mA | 500mA